# Altium schematic sheet MEMORY.SchDoc
size A
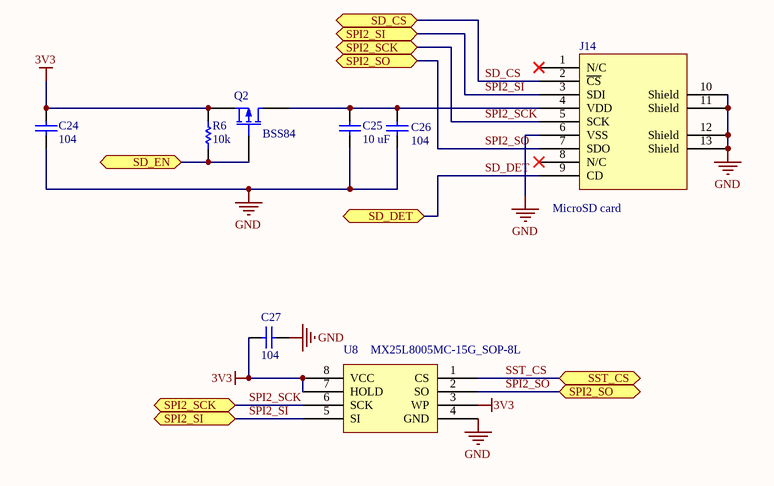
[diagram p0: MEMORY.SchDoc]

## Parts
C24  104  [C0603]
C25  10 uF  [C1210]
C26  104  [C0603]
C27  104  [C0603]
J14  MicroSD card  [MICROSD SOCKET CPSDBT5]
Q2  BSS84  [SOT23-3]
R6  10k  [R0603]
U8  MX25L8005MC-15G_SOP-8L  [FLASH_IC]

## Ports
SD_CS, SD_DET, SD_EN, SPI2_SCK, SPI2_SI, SPI2_SO, SST_CS

## Nets
3V3: C24.2 C27.2 Q2.2(S) R6.1 U8.3(WP) U8.7(HOLD) U8.8(VCC)
GND: C24.1 C25.1 C26.1 C27.1 J14.6(VSS) J14.10(Shield) J14.11(Shield) J14.12(Shield) J14.13(Shield) U8.4(GND)
SD_CS: J14.2(~{CS}) ; port SD_CS
SD_DET: J14.9(CD) ; port SD_DET
SD_EN: Q2.1(G) R6.2 ; port SD_EN
SPI2_SCK: J14.5(SCK) U8.6(SCK) ; port SPI2_SCK
SPI2_SI: J14.3(SDI) U8.5(SI) ; port SPI2_SI
SPI2_SO: J14.7(SDO) U8.2(SO) ; port SPI2_SO
SST_CS: U8.1(CS) ; port SST_CS
NetC25_2: C25.2 C26.2 J14.4(VDD) Q2.3(D)

Not connected (* = marked no-connect by the designer): J14 1(N/C)* 8(N/C)*

## Library data of the parts
C24-C27 = Cap_SMT: CAP CER 0.1UF 16V Y5V 0402; Manufacturer: Yageo; Manufacturer Part Number: CC0603ZRY5V7BB104; Published: 8-Jun-2000; LatestRevisionDate: 17-Jul-2002; LatestRevisionNote: Re-released for DXP Platform.; PackageReference: C0603; Publisher: Altium Limited; Digi-Key Part Number: 311-1047-1-ND; Unit Price: 0.00648
  C24 C26 C27: Value: 104
  C25: Value: 10 uF
J14 = uSD Push-Push Socket: Digi-Key Part Number: NA
Q2 = MOSFET-P GSD: MOSFET P-CH 50V 130MA SOT23-3; Manufacturer: Diodes Inc; Manufacturer Part Number: BSS84-7-F; Published: 8-Jun-2000; LatestRevisionDate: 17-Jul-2002; LatestRevisionNote: Re-released for DXP Platform.; PackageVersion: 1995/1996; PackageReference: E3; Publisher: Altium Limited; Digi-Key Part Number: BSS84-FDITR-ND; Unit Price: 0.06000
R6 = R_SMD5: Resistor SMD 5%; Manufacturer: Panasonic Electronic Components; Manufacturer Part Number: ERJ-2RKF3241X; Published: 8-Jun-2000; LatestRevisionDate: 17-Jul-2002; LatestRevisionNote: Re-released for DXP Platform.; PackageReference: R0603; Publisher: Altium Limited; Digi-Key Part Number: P3.24KLTR-ND; Unit Price: 0.00203; Value: 10k
U8 = MX25L8005MC-15G_SOP-8L: Digi-Key Part Number: 1092-1106-ND